# Altium schematic sheet nRF52832&pin_map.SchDoc: nRF52832 & pin map
size A4; DrawnBy: D.N.Nhuan; DocumentNumber: 1; Revision: NB-1.0; SheetNumber: 1; SheetTotal: 2
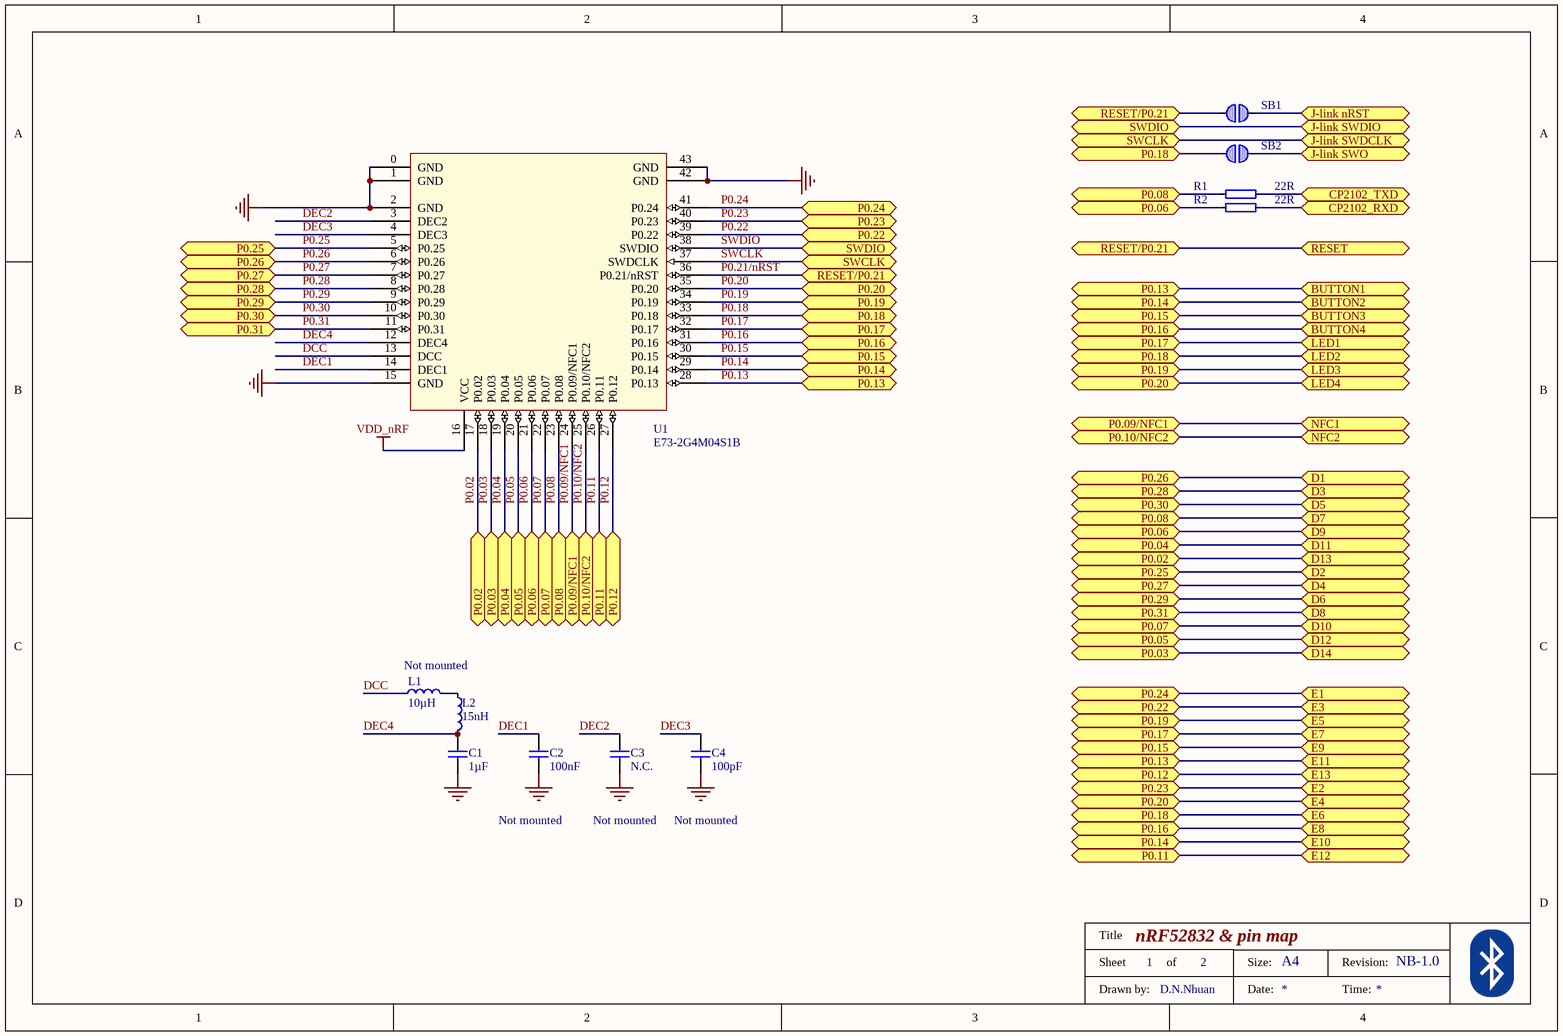
[diagram p0: nRF52832&pin_map.SchDoc]

## Parts
C1  1µF  [0603_Imperial]
C2  100nF  [0402 imperial]
C3  N.C.  [0402 imperial]
C4  100pF  [0402 imperial]
L1  10µH  [0603_Imperial]
L2  15nH  [0402 imperial]
R1  22R  [0402 imperial]
R2  22R  [0402 imperial]
SB1  Solderbridge  [Solderbridge]  (value not drawn)  (no BOM)
SB2  Solderbridge  [Solderbridge]  (value not drawn)  (no BOM)
U1  E73-2G4M04S1B  [nRF52832-Ebyte]

## Ports
BUTTON1, BUTTON2, BUTTON3, BUTTON4, CP2102_RXD, CP2102_TXD, D1, D2, D3, D4, D5, D6, D7, D8, D9, D10, D11, D12, D13, D14, E1, E2, E3, E4, E5, E6, E7, E8, E9, E10, E11, E12, E13, J-link nRST, J-link SWDCLK, J-link SWDIO, J-link SWO, LED1, LED2, LED3, LED4, NFC1, NFC2, P0.02, P0.03, P0.04, P0.05, P0.06, P0.07, P0.08, P0.09/NFC1, P0.10/NFC2, P0.11, P0.12, P0.13, P0.14, P0.15, P0.16, P0.17, P0.18, P0.19, P0.20, P0.22, P0.23, P0.24, P0.25, P0.26, P0.27, P0.28, P0.29, P0.30, P0.31, RESET, RESET/P0.21, SWCLK, SWDIO

## Nets
GND: C1.1 C2.1 C3.1 C4.1 U1.0(GND) U1.1(GND) U1.2(GND) U1.15(GND) U1.42(GND) U1.43(GND)
VDD_nRF: U1.16(VCC)
CP2102_RXD: R2.2 ; port CP2102_RXD
CP2102_TXD: R1.2 ; port CP2102_TXD
DCC: L1.1 U1.13(DCC)
DEC1: C2.2 U1.14(DEC1)
DEC2: C3.2 U1.3(DEC2)
DEC3: C4.2 U1.4(DEC3)
DEC4: C1.2 L2.2 U1.12(DEC4)
J-link nRST: SB1.1 ; port J-link nRST
J-link SWO: SB2.1 ; port J-link SWO
P0.02: U1.17(P0.02) ; port P0.02, port D13
P0.03: U1.18(P0.03) ; port P0.03, port D14
P0.04: U1.19(P0.04) ; port P0.04, port D11
P0.05: U1.20(P0.05) ; port P0.05, port D12
P0.06: R2.1 U1.21(P0.06) ; port P0.06, port D9
P0.07: U1.22(P0.07) ; port P0.07, port D10
P0.08: R1.1 U1.23(P0.08) ; port P0.08, port D7
P0.09/NFC1: U1.24(P0.09/NFC1) ; port P0.09/NFC1, port NFC1
P0.10/NFC2: U1.25(P0.10/NFC2) ; port P0.10/NFC2, port NFC2
P0.11: U1.26(P0.11) ; port E12, port P0.11
P0.12: U1.27(P0.12) ; port E13, port P0.12
P0.13: U1.28(P0.13) ; port P0.13, port BUTTON1, port E11
P0.14: U1.29(P0.14) ; port P0.14, port BUTTON2, port E10
P0.15: U1.30(P0.15) ; port P0.15, port BUTTON3, port E9
P0.16: U1.31(P0.16) ; port P0.16, port BUTTON4, port E8
P0.17: U1.32(P0.17) ; port P0.17, port LED1, port E7
P0.18: SB2.2 U1.33(P0.18) ; port P0.18, port LED2, port E6
P0.19: U1.34(P0.19) ; port P0.19, port LED3, port E5
P0.20: U1.35(P0.20) ; port P0.20, port LED4, port E4
P0.21/nRST: SB1.2 U1.36(P0.21/nRST) ; port RESET/P0.21, port RESET
P0.22: U1.39(P0.22) ; port P0.22, port E3
P0.23: U1.40(P0.23) ; port P0.23, port E2
P0.24: U1.41(P0.24) ; port P0.24, port E1
P0.25: U1.5(P0.25) ; port P0.25, port D2
P0.26: U1.6(P0.26) ; port P0.26, port D1
P0.27: U1.7(P0.27) ; port P0.27, port D4
P0.28: U1.8(P0.28) ; port P0.28, port D3
P0.29: U1.9(P0.29) ; port P0.29, port D6
P0.30: U1.10(P0.30) ; port P0.30, port D5
P0.31: U1.11(P0.31) ; port P0.31, port D8
SWCLK: U1.37(SWDCLK) ; port SWCLK, port J-link SWDCLK
SWDIO: U1.38(SWDIO) ; port SWDIO, port J-link SWDIO
NetL1_2: L1.2 L2.1

## Notes on the sheet
- Not mounted
- Title
- Sheet
- of
- Size:
- A4
- Revision:
- Drawn by:
- Date:
- Time:

## Library data of the parts
C1-C4 = Capacitor: common library; Tolerance: ±5%; Suppiler: *; Link of Supplier: *; Manufacturer: *; Manufacturer Part Number: *; Footprint: 0402
  C1: Value: 1µF
  C2: Value: 100nF
  C3: Value: N.C.
  C4: Value: 100pF
L1 L2 = Inductor: common library; Supplier: *; Link of Supplier: *; Maximum Current: *; Footprint: 0402
  L1: Value: 10µH
  L2: Value: 15nH
R1 R2 = Resistor: common library; Tolerance: ±5%; Value: 22R; Supplier: *; Link of Supplier: *; Footprint: 0402
SB1 SB2 = Solderbridge: Artikkelnr Noca: N.A.; Part Number: Solderbridge; Manufacturer: *; Manufacturer Part Number: *; Datasheet: *; LatestRevisionDate: 2009-12-14; Pin Count: 2; Publisher: Nordic Semiconductor; Published: 2009-12-14; Value: Solderbridge; Note: *; Supplier: *; Supplier part number: *; 2nd source Supplier: *; 2nd source part number: *; Footprint Doc: Solderbridge; Artikkelnr Simpro: N.A.
U1 = nRF52832-Ebyte: Ebyte E73-2G4M04S-52832; Part Number: E73-2G4M04S1B; Type: nRF52832 module; Manufacturer: EBYTE